# EAGLE design comma_access_point (EAGLE 9.4.2)
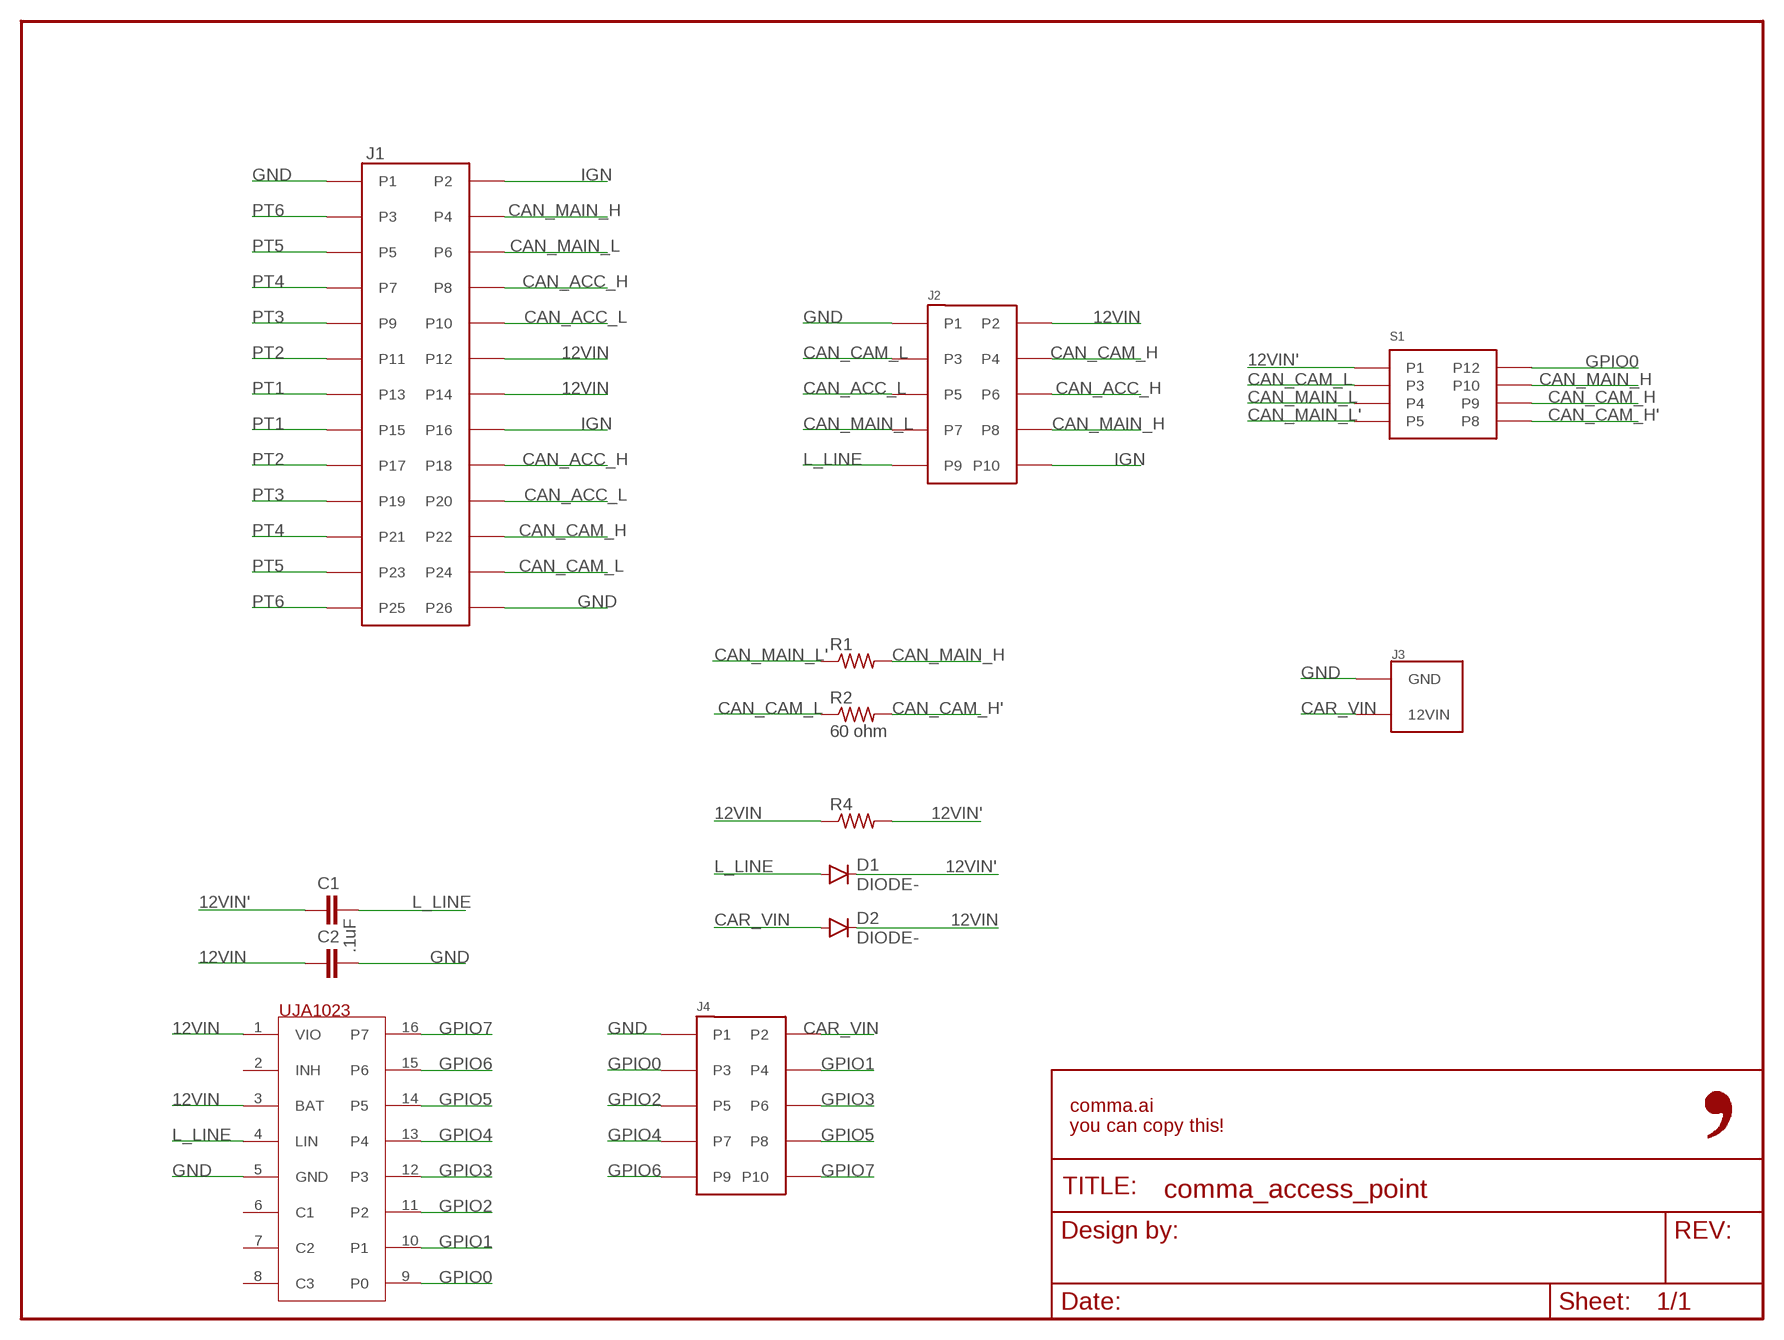
[diagram p0: schematic, sheet 1]

## Parts
C1  C0805  [0805-C]
C2  .1uF  C0805  [0805-C]
D1  DIODE-  [DO-214]
D2  DIODE-  [DO-214]
FRAME1  FRAME-LETTER-OPENNO_PACKAGE  [DUMMY]
IC1  UJA1023  [SO16]
J1  5018762640  [5018762640]
J2  5018761040  [5018761040]
J3  3-794618-2  [3-794618-2]
J4  5018761040  [5018761040]
R1  R0402  [0402-R]
R2  60 ohm  R0402  [0402-R]
R4  R0402  [0402-R]
S1  G6S-2G-DC12  [G6S-26-DC12]

## Nets
12VIN: C2.1 D2.1(C) IC1.1(VIO) IC1.3(BAT) J1.P12 J1.P14 J2.P2 R4.1
12VIN': C1.1 D1.1(C) R4.2 S1.P1
CAN_ACC_H: J1.P8 J1.P18 J2.P6
CAN_ACC_L: J1.P10 J1.P20 J2.P5
CAN_CAM_H: J1.P22 J2.P4 S1.P9
CAN_CAM_H': R2.2 S1.P8
CAN_CAM_L: J1.P24 J2.P3 R2.1 S1.P3
CAN_MAIN_H: J1.P4 J2.P8 R1.2 S1.P10
CAN_MAIN_L: J1.P6 J2.P7 S1.P4
CAN_MAIN_L': R1.1 S1.P5
CAR_VIN: D2.2(A) J3.12VIN J4.P2
GND: C2.2 IC1.5(GND) J1.P1 J1.P26 J2.P1 J3.GND J4.P1
GPIO0: IC1.9(P0) J4.P3 S1.P12
GPIO1: IC1.10(P1) J4.P4
GPIO2: IC1.11(P2) J4.P5
GPIO3: IC1.12(P3) J4.P6
GPIO4: IC1.13(P4) J4.P7
GPIO5: IC1.14(P5) J4.P8
GPIO6: IC1.15(P6) J4.P9
GPIO7: IC1.16(P7) J4.P10
IGN: J1.P2 J1.P16 J2.P10
L_LINE: C1.2 D1.2(A) IC1.4(LIN) J2.P9
PT1: J1.P13 J1.P15
PT2: J1.P11 J1.P17
PT3: J1.P9 J1.P19
PT4: J1.P7 J1.P21
PT5: J1.P5 J1.P23
PT6: J1.P3 J1.P25
Unconnected: IC1.2(INH) IC1.6(C1) IC1.7(C2) IC1.8(C3)

## Library data of the parts
C1 C2 = comma.ai:C
D1 D2 = comma.ai:DIODE
FRAME1 = comma.ai:FRAME-LETTER-OPEN: Schematic Frame - Letter Standard 8.5x11 US Letter frame; DESIGNER: Nobody; VERSION: v01
IC1 = uja1023:UJA1023: UJA1023 LIN-I/O slave
J1 = 5018761440:5018762640
J2 J4 = 5018761440:5018761040
J3 = 3-794618-2:3-794618-2
R1 R2 R4 = comma.ai:R
S1 = UD2-5SNU:G6S-2G-DC12

## Board
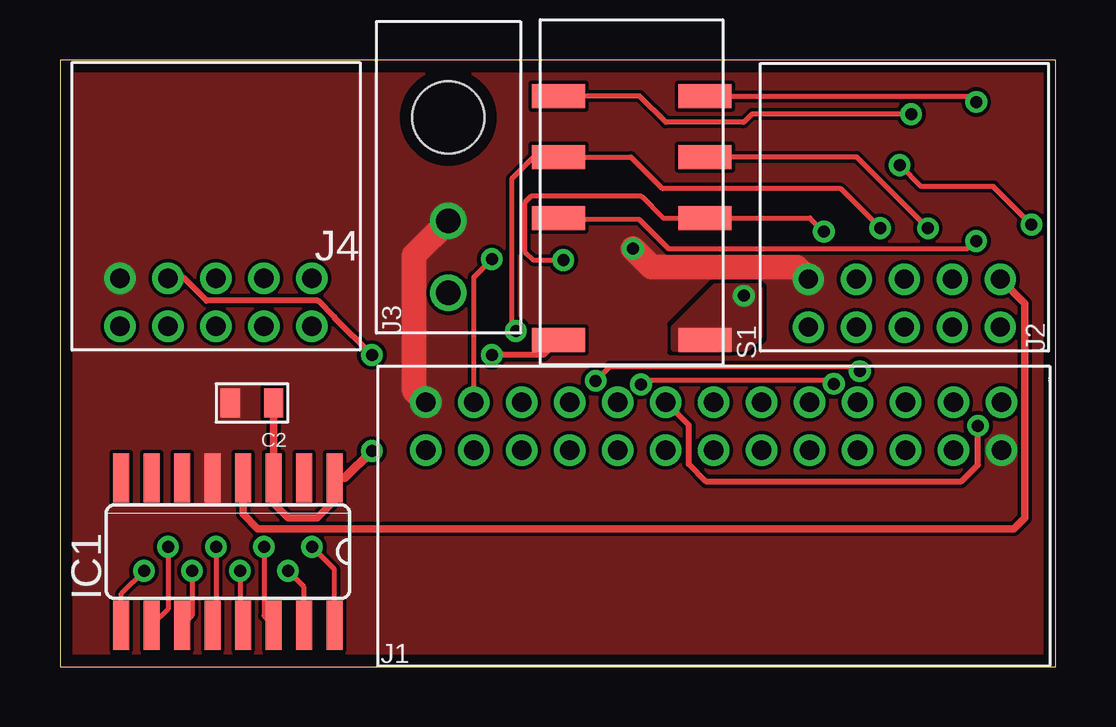
[diagram p1: board, top side]
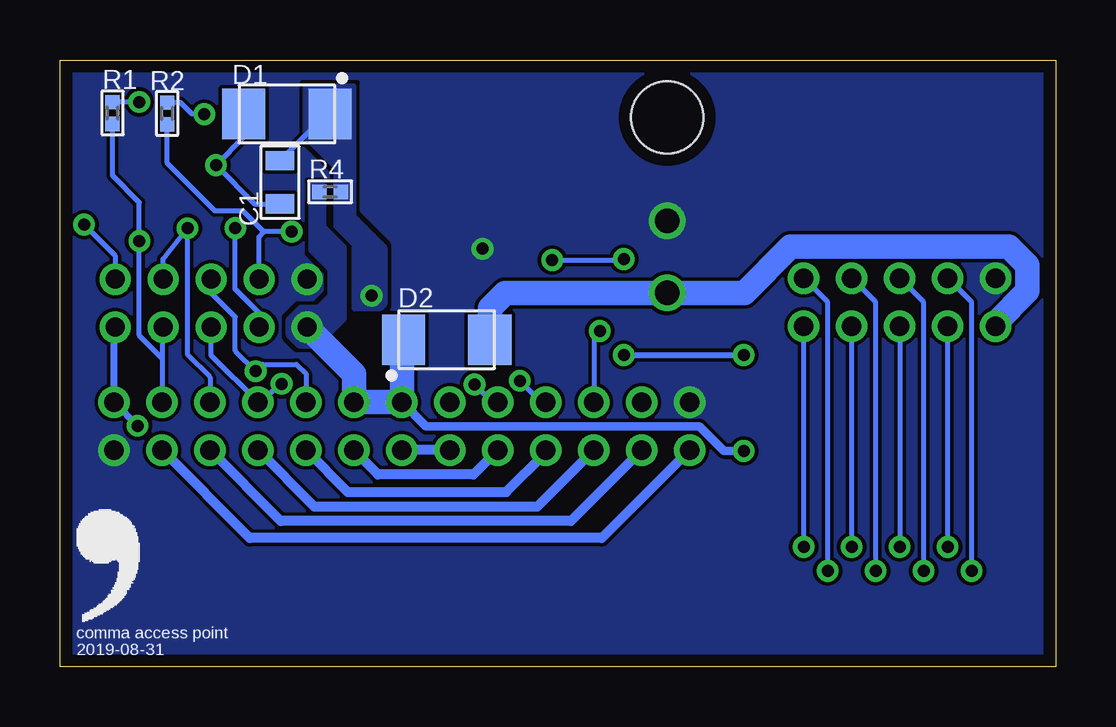
[diagram p2: board, bottom side, seen from below]

Size 41.5 x 25.3 mm. Coordinates in mm from the lower left corner, seen from the top.
Outline: 0,0 41.5,0 41.5,25.3 0,25.3 0,0
Copper layers (1*16): Top 0.035mm / dielectric 1.5mm / Bottom 0.035mm
Design rules "default *": minimum track width 6mil, minimum drill 0.35mm, track to track 6mil, track to pad 6mil, pad to pad 6mil, via to via 6mil, smd to smd 6mil, copper to edge 20mil, drill to drill 6mil, minimum pad ring 10mil, minimum via ring 8mil, stop-mask expansion 4mil, vias tented up to drill 0mil, thermal gap 10mil

### Footprints (pad centres in the part's own frame; a part is rotated, then mirrored left to right if it is on the bottom)
0805-C = smd 0.8 x 1.2: 1 -0.9,0; 2 0.9,0
DO-214 = smd 1.8 x 2.1: 1 -1.8,0; 2 1.8,0
SO16 = smd 0.66 x 2.032: 1 -4.445,-3.073; 2 -3.175,-3.073; 3 -1.905,-3.073; 4 -0.635,-3.073; 5 0.635,-3.073; 6 1.905,-3.073; 7 3.175,-3.073; 8 4.445,-3.073; 9 4.445,3.073; 10 3.175,3.073; 11 1.905,3.073; 12 0.635,3.073; 13 -0.635,3.073; 14 -1.905,3.073; 15 -3.175,3.073; 16 -4.445,3.073
5018762640 = drill 0.8: P1 12,-1; P2 12,1; P3 10,-1; P4 10,1; P5 8,-1; P6 8,1; P7 6,-1; P8 6,1; P9 4,-1; P10 4,1; P11 2,-1; P12 2,1; P13 0,-1; P14 0,1; P15 -2,-1; P16 -2,1; P17 -4,-1; P18 -4,1; P19 -6,-1; P20 -6,1; P21 -8,-1; P22 -8,1; P23 -10,-1; P24 -10,1; P25 -12,-1; P26 -12,1
5018761040 = drill 0.8: P1 5,-1; P2 5,1; P3 3,-1; P4 3,1; P5 1,-1; P6 1,1; P7 -1,-1; P8 -1,1; P9 -3,-1; P10 -3,1
3-794618-2 = drill 1.02: 12VIN 0,7.32; GND 0,4.32 | hole 3: 0,0
0402-R = smd 0.6 x 0.6: 1 -0.45,0; 2 0.45,0
G6S-26-DC12 = smd 1 x 2.2: P1 -6.35,-3.05; P3 -1.27,-3.05; P4 1.27,-3.05; P5 3.81,-3.05; P8 3.81,3.05; P9 1.27,3.05; P10 -1.27,3.05; P12 -6.35,3.05

### Placement (x,y rotation side)
C1  32.33,20.2 270 bottom
C2  8,11 180 top
D1  32.04,23.04 180 bottom
D2  25.38,13.64 0 bottom
FRAME1  -6.35,8.89 0 top  (outside the outline)
IC1  7,4.8 180 top
J1  27.25,10.03 0 top
J2  36.2,15.16 180 top
J3  16.19,22.91 180 top
J4  7.5,15.2 180 top
R1  39.31,23.09 270 bottom
R2  37.03,23.07 90 bottom
R4  30.24,19.8 0 bottom
S1  23.83,19.98 90 top
U$1  [LOGO]  41.46,1.57 0 bottom

### Tracks (layer width: path | path; a pad name or v marks a point on that pad's centre or on a via)
12VIN  (via drill 0.5)
  Top 0.305: IC1.1 11.45,6.95 10.71,6.21 9.5,6.21 8.9,6.81 IC1.3 C2.1
  Top 0.36: v13,9 11.87,7.87 IC1.1
  Bottom 0.36: J1.P14 26.24,10.02 14.84,10.02 13.82,9 v13,9
  Bottom 1.016: J2.P2 29.25,12.21 J1.P12 J1.P14 27.25,13.57 D2.1
  pour Bottom (no thermals): 31.06,20.13 31.06,17.37 30.27,16.58 30.27,15.46 30.75,14.98 31.47,14.98 32.01,14.44 32.01,13.86 31.53,13.38 30.77,13.38 29.63,14.52 29.63,17.47 30.49,18.33 30.49,20.04 30.48,20.05 30.58,20.15 31.05,20.15
12VIN'  (via drill 0.5)
  Bottom 0.203: C1.1 30.39,23.04 D1.1
  other vias: 28.51,15.47
  pour Top (no thermals): 25.56,14.13 25.56,13.25 28.65,13.25 29.22,13.82 29.22,15.7 28.94,15.98 27.41,15.98
  pour Bottom (no thermals): 29.26,24.22 29.26,21.93 29.27,21.94 29.27,18.79 27.95,17.47 27.95,15.13 28.16,14.92 29.22,14.92 29.22,17.59 29.99,18.36 29.99,20.82 31.26,22.09 31.26,24.22
CAN_ACC_H  (via drill 0.5)
  Top 0.203: v32.27,11.8 32.14,11.92 32.13,11.94 24.4,11.94 v24.23,11.77 v24.22,11.77
  Bottom 0.203: J2.P6 35.2,12.98 J1.P8 33.1,11.03 32.3,11.84 v32.27,11.8 | v24.22,11.77 23.48,11.03 J1.P18
CAN_ACC_L  (via drill 0.5)
  Top 0.203: v22.33,11.92 22.92,12.51 33.15,12.51 v33.34,12.32
  Bottom 0.203: J2.P5 35.2,15.59 34.19,14.58 34.19,13.17 v33.34,12.32 33.05,12.61 31.64,12.61 31.25,12.22 J1.P10 | v22.33,11.92 21.44,11.03 J1.P20
CAN_CAM_H  (via drill 0.5)
  Top 0.203: v34.19,18.29 32.55,19.93 25.12,19.93 23.8,21.25 S1.P9 19.74,21.25 18.83,20.34 18.83,14.17 v19,14
  Bottom 0.203: J2.P4 33.2,14.76 34.2,15.75 v34.2,18.28 v34.19,18.29 | v19,14 19.25,13.75 J1.P22
CAN_CAM_H'  (via drill 0.5)
  Top 0.203: S1.P8 24.16,23.79 25.25,22.7 28.51,22.7 28.85,23.04 v35.48,23.04
  Bottom 0.203: v35.48,23.04 36,23.04 36.48,23.52 R2.2
CAN_CAM_L  (via drill 0.5)
  Top 0.203: v20.98,16.96 19.73,16.96 19.37,17.32 19.37,19.35 19.64,19.62 24.23,19.62 25.14,18.71 S1.P3 31.27,18.71 v31.84,18.14 | J1.P24 17.25,16.25 v18,17
  Bottom 0.203: R2.1 37.03,20.99 35.04,19 33.87,19 33.01,18.14 32.98,18.14 | v31.84,18.14 32.98,18.14 | J2.P3 33.2,17.92 32.98,18.14 | v20.98,16.96 18.04,16.96 v18,17
CAN_MAIN_H  (via drill 0.5)
  Top 0.203: S1.P10 20.84,18.65 24.15,18.65 25.37,17.43 37.82,17.43 38.14,17.75 v38.19,17.75
  Bottom 0.203: 37.23,12.86 37.23,11.05 J1.P4 | 37.23,12.86 38.19,13.82 v38.19,17.75 38.19,19.36 39.31,20.48 R1.2 | J2.P8 37.23,14.13 37.23,12.86
CAN_MAIN_L  (via drill 0.5)
  Top 0.203: v36.18,18.28 33.22,21.25 S1.P4
  Bottom 0.203: J1.P6 35.25,12.07 36.17,12.99 v36.18,18.28 37.2,17.01 J2.P7
CAN_MAIN_L'  (via drill 0.5)
  Top 0.203: v38.2,23.55 37.96,23.79 S1.P5
  Bottom 0.203: v38.2,23.55 v38.2,23.54 R1.1
CAR_VIN
  Bottom 1.016: D2.2 23.57,14.96 22.94,15.59 J3.12VIN 12.97,15.59 11.04,17.51 1.96,17.51 1.19,16.74 1.19,15.66 2.5,14.34 J4.P2
GND  (via drill 0.5)
  Top 1.016: J2.P1 30.7,16.66 24.66,16.66 v23.89,17.43 | J3.GND 14.77,17.16 14.77,11.52 J1.P26
  pour Top (rank 2, no thermals): -0.31,25.53 -0.31,-0.17 -0.21,-0.27 41.59,-0.27 41.89,0.03 41.89,25.33 41.59,25.63 -0.11,25.63
  pour Bottom (rank 2, no thermals): -0.31,25.63 -0.31,-0.17 -0.21,-0.27 41.59,-0.27 41.89,0.03 41.89,25.63
GPIO0  (via drill 0.5)
  Top 0.203: IC1.9 2.56,3.06 v3.5,4
  Top 0.254: S1.P12 20.15,13 v18,13 | v13,13 11.43,14.57 11.43,14.59 10.75,15.27 6.11,15.27 5.18,16.2 J4.P3
  Bottom 0.203: v3.5,4 3.5,15.2 J4.P3
  Bottom 0.254: v18,13 v13,13
GPIO1  (via drill 0.5)
  Top 0.203: v4.5,5 4.5,2.4 IC1.10
  Bottom 0.203: v4.5,5 J4.P4
GPIO2  (via drill 0.5)
  Top 0.203: v5.5,4 5.5,2.13 IC1.11
  Bottom 0.203: v5.5,4 5.5,15.2 J4.P5
GPIO3  (via drill 0.5)
  Top 0.203: v6.5,5 6.5,1.86 IC1.12
  Bottom 0.203: J4.P6 v6.5,5
GPIO4  (via drill 0.5)
  Top 0.203: v7.5,4 7.5,1.86 IC1.13
  Bottom 0.203: v7.5,4 7.5,15.2 J4.P7
GPIO5  (via drill 0.5)
  Top 0.203: v8.5,5 8.5,2.13 IC1.14
  Bottom 0.203: v8.5,5 J4.P8
GPIO6  (via drill 0.5)
  Top 0.203: IC1.15 10.18,3.33 v9.5,4
  Bottom 0.203: v9.5,4 9.5,15.2 J4.P9
GPIO7  (via drill 0.5)
  Top 0.203: IC1.16 11.45,4.05 v10.5,5
  Bottom 0.203: v10.5,5 J4.P10
IGN  (via drill 0.5)
  Top 0.254: v38.27,10.05 38.27,8.42 37.58,7.73 26.93,7.73 26.21,8.45 26.21,10 26.21,10.07 J1.P16
  Bottom 0.284: J2.P10 39.25,14.11 J1.P2 v38.27,10.05
L_LINE  (via drill 0.5)
  Top 0.203: v35,20.91 35.89,20.02 38.91,20.02 v40.49,18.43
  Top 0.305: J2.P9 40.21,15.15 40.21,6.21 39.76,5.76 8.24,5.76 7.63,6.37 IC1.4
  Bottom 0.203: D1.2 33.84,22.07 v35,20.91 33.39,19.3 C1.2 | J2.P9 39.2,17.14 v40.49,18.43
PT1
  Bottom 0.406: J1.P15 J1.P13
PT2
  Bottom 0.203: 29.25,9.01 J1.P11
  Bottom 0.406: J1.P17 24.27,8.01 28.25,8.01 29.25,9.01
PT3
  Bottom 0.406: J1.P9 29.5,7.29 22.91,7.29 21.25,8.94 J1.P19
PT4
  Bottom 0.406: J1.P21 21.61,6.67 30.89,6.67 J1.P7
PT5
  Bottom 0.406: J1.P23 20.2,6.08 32.3,6.08 J1.P5
PT6
  Bottom 0.406: J1.P25 18.91,5.37 33.59,5.37 J1.P3

### Text on the board
bPlace: comma access point | 2019-08-31